# EAGLE design snes-bt2 (EAGLE 6.1)
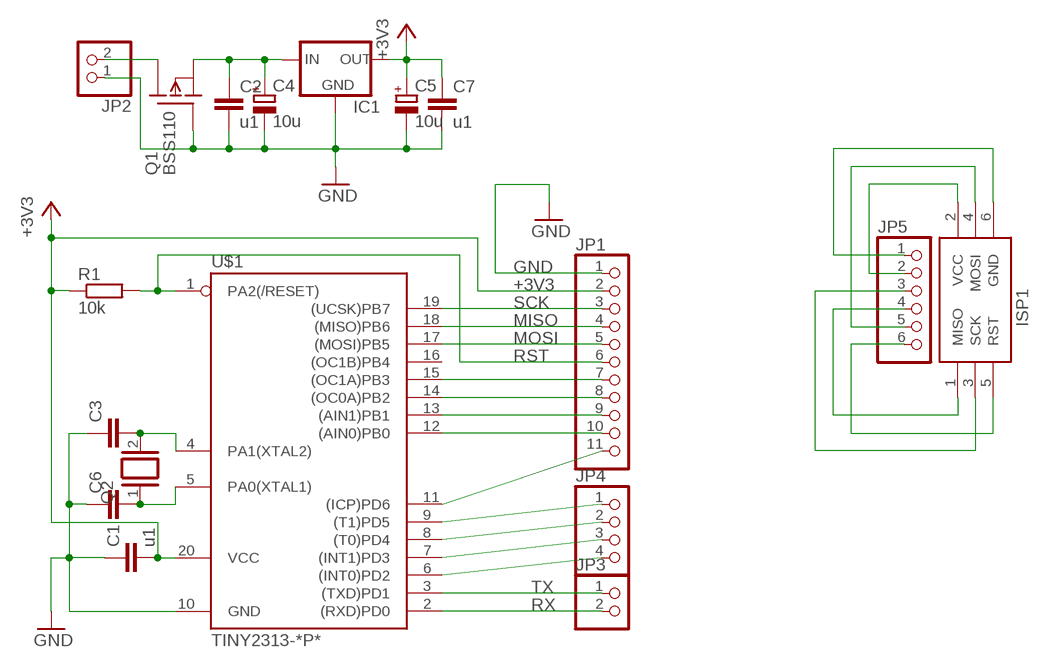
[diagram p0: schematic, sheet 1]

## Parts
C1  u1  C-EU025-025X050  [C025-025X050]
C2  u1  C-EU025-025X050  [C025-025X050]
C3  C-EUC0805K  [C0805K]
C4  10u  CPOL-EUE2,5-6E  [E2,5-6E]
C5  10u  CPOL-EUE2,5-6E  [E2,5-6E]
C6  C-EUC0805K  [C0805K]
C7  u1  C-EU025-025X050  [C025-025X050]
IC1  MCP1700_TO92-THIN  [TO-92]
ISP1  AVRISP-6  [AVRISP]
JP1  PINHD-1X11  [1X11]
JP2  PINHD-1X2  [1X02]
JP3  PINHD-1X2  [1X02]
JP4  PINHD-1X4  [1X04]
JP5  PINHD-1X6  [1X06]
Q1  BSS110  [TO92]
Q2  XTAL/S  [QS]
R1  10k  R-EU_0204/7  [0204/7]
U$1  TINY2313-*P*  [DIL20]

## Nets
+3V3: C1.2 C5.+ C7.1 IC1.3(OUT) JP1.2 R1.1 U$1.20(VCC)
GND: C1.1 C2.2 C3.1 C4.- C5.- C6.1 C7.2 IC1.1(GND) JP1.1 JP2.1 Q1.2(G) U$1.10(GND)
ISP_GND: ISP1.6(GND) JP5.1
MISO: JP1.4 U$1.18((MISO)PB6)
MOSI: JP1.5 U$1.17((MOSI)PB5)
N$1: C6.2 Q2.1 U$1.5(PA0(XTAL1))
N$2: C3.2 Q2.2 U$1.4(PA1(XTAL2))
N$3: JP1.11 U$1.11((ICP)PD6)
N$4: ISP1.2(VCC) JP5.2
N$5: C2.1 C4.+ IC1.2(IN) Q1.1(S)
N$6: JP2.2 Q1.3(D)
N$8: ISP1.4(MOSI) JP5.5
N$9: ISP1.1(MISO) JP5.4
N$10: ISP1.5(RST) JP5.6
N$11: ISP1.3(SCK) JP5.3
N$14: JP1.7 U$1.15((OC1A)PB3)
N$15: JP1.8 U$1.14((OC0A)PB2)
N$16: JP1.9 U$1.13((AIN1)PB1)
N$17: JP1.10 U$1.12((AIN0)PB0)
N$21: JP4.1 U$1.9((T1)PD5)
N$22: JP4.2 U$1.8((T0)PD4)
N$23: JP4.3 U$1.7((INT1)PD3)
N$24: JP4.4 U$1.6((INT0)PD2)
RST: JP1.6 R1.2 U$1.1(PA2(/RESET))
RX: JP3.2 U$1.2((RXD)PD0)
SCK: JP1.3 U$1.19((UCSK)PB7)
TX: JP3.1 U$1.3((TXD)PD1)
Unconnected: U$1.16((OC1B)PB4)

## Library data of the parts
C1-C3 C6 C7 = rcl:C-EU: CAPACITOR, European symbol
C4 C5 = rcl:CPOL-EU: POLARIZED CAPACITOR, European symbol
IC1 = _MY_OWN_LIB:MCP1700: VOLTAGE REGULATOR
ISP1 = adafruit:AVRISP: AVR ISP HEADER Standard 6 pin header for AVR programming
JP1 = pinhead:PINHD-1X11: PIN HEADER
JP2 JP3 = pinhead:PINHD-1X2: PIN HEADER
JP4 = pinhead:PINHD-1X4: PIN HEADER
JP5 = pinhead:PINHD-1X6: PIN HEADER
Q1 = transistor-fet:BSS110: P-Channel Enhancement MOSFET -50V; -0,17A; 6Ohm
Q2 = special:XTAL/S: CRYSTAL
R1 = rcl:R-EU_: RESISTOR, European symbol
U$1 = avr-7:TINY2313*: Atmel Tiny2313 2K Flash, 128 bytes EEPROM, 128 bytes RAM

## Board
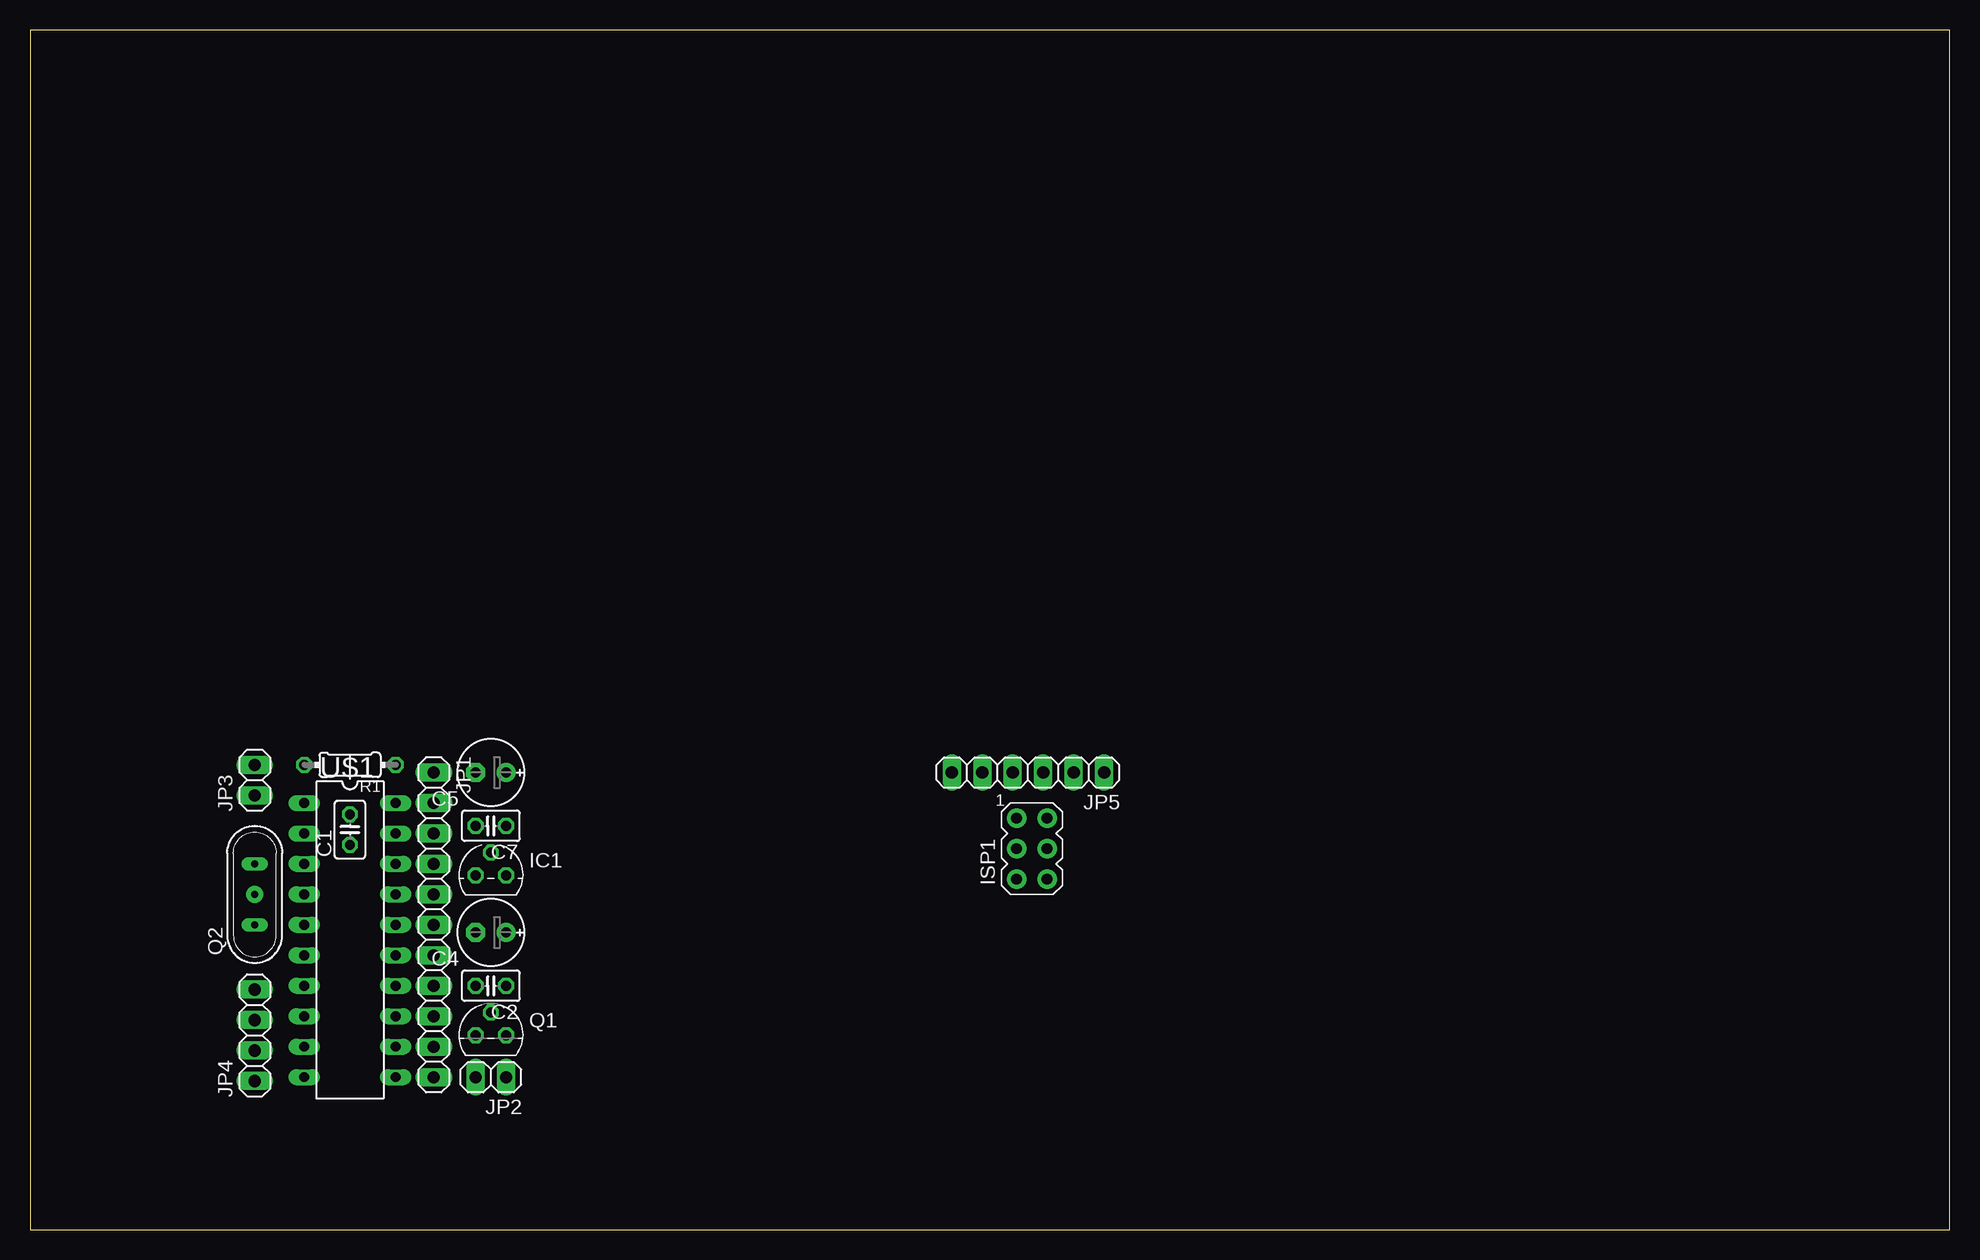
[diagram p1: board, top side]
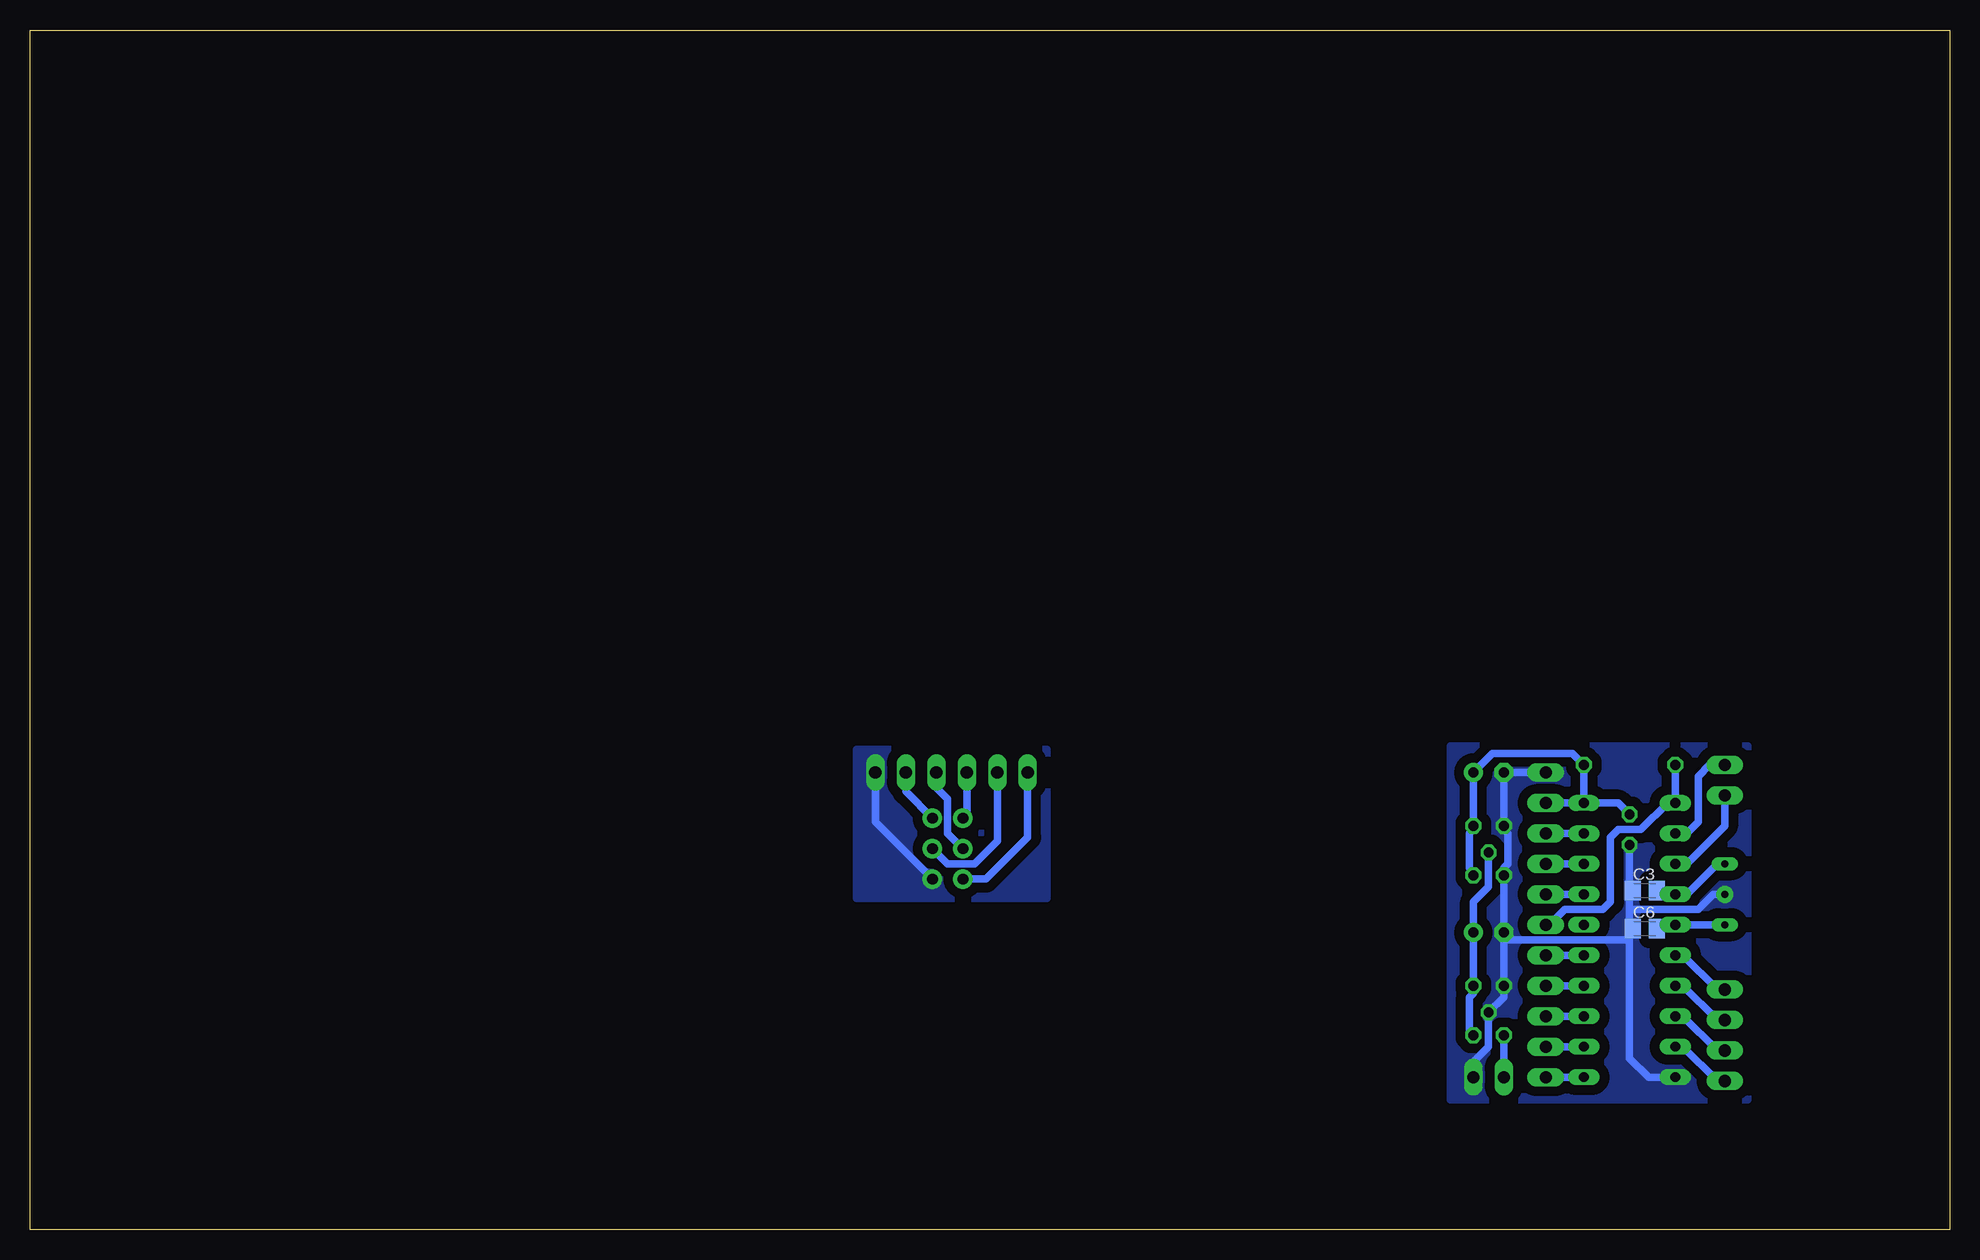
[diagram p2: board, bottom side, seen from below]

Size 160 x 100 mm. Coordinates in mm from the lower left corner, seen from the top.
Outline: 0,0 160,0 160,100 0,100 0,0
Copper layers (1*16): Top 0.035mm / dielectric 1.5mm / Bottom 0.035mm
Design rules: minimum track width 10mil, minimum drill 24mil, track to track 8mil, track to pad 8mil, pad to pad 8mil, via to via 8mil, smd to smd 8mil, copper to edge 40mil, drill to drill 8mil, minimum pad ring 10mil, minimum via ring 8mil, stop-mask expansion 4mil, vias tented up to drill 0mil, thermal gap 10mil

### Footprints (pad centres in the part's own frame; a part is rotated, then mirrored left to right if it is on the bottom)
C025-025X050 = drill 0.813 octagon: 1 -1.27,0; 2 1.27,0
C0805K = smd 1.3 x 1.6: 1 -1,0; 2 1,0
E2,5-6E = drill 0.813 pad 1.575: + -1.27,0 | drill 0.813 pad 1.575 octagon: - 1.27,0
TO-92 = drill 0.813 octagon: 1 -1.27,0; 2 0,1.905; 3 1.27,0
AVRISP = drill 0.9 pad 1.626: 1 -1.27,2.54; 2 1.27,2.54; 3 -1.27,0; 4 1.27,0; 5 -1.27,-2.54; 6 1.27,-2.54
1X11 = drill 1.016 long: 1 -12.7,0; 2 -10.16,0; 3 -7.62,0; 4 -5.08,0; 5 -2.54,0; 6 0,0; 7 2.54,0; 8 5.08,0; 9 7.62,0; 10 10.16,0; 11 12.7,0
1X02 = drill 1.016 long: 1 -1.27,0; 2 1.27,0
1X04 = drill 1.016 long: 1 -3.81,0; 2 -1.27,0; 3 1.27,0; 4 3.81,0
1X06 = drill 1.016 long: 1 -6.35,0; 2 -3.81,0; 3 -1.27,0; 4 1.27,0; 5 3.81,0; 6 6.35,0
TO92 = drill 0.813 octagon: 1 1.27,0; 2 0,1.905; 3 -1.27,0
QS = drill 0.61 long: 1 -2.54,0; 2 2.54,0
0204/7 = drill 0.813 octagon: 1 -3.81,0; 2 3.81,0
DIL20 = drill 0.813 long: 1 -11.43,-3.81; 2 -8.89,-3.81; 3 -6.35,-3.81; 4 -3.81,-3.81; 5 -1.27,-3.81; 6 1.27,-3.81; 7 3.81,-3.81; 8 6.35,-3.81; 9 8.89,-3.81; 10 11.43,-3.81; 11 11.43,3.81; 12 8.89,3.81; 13 6.35,3.81; 14 3.81,3.81; 15 1.27,3.81; 16 -1.27,3.81; 17 -3.81,3.81; 18 -6.35,3.81; 19 -8.89,3.81; 20 -11.43,3.81

### Placement (x,y rotation side)
C1  26.67,33.34 90 top
C2  38.42,20.32 180 top
C3  25.4,28.26 0 bottom
C4  38.42,24.77 180 top
C5  38.42,38.1 180 top
C6  25.4,25.08 0 bottom
C7  38.42,33.66 180 top
IC1  38.42,29.53 0 top
ISP1  83.5,31.75 0 top
JP1  33.66,25.4 270 top
JP2  38.42,12.7 180 top
JP3  18.73,37.47 90 top
JP4  18.73,16.19 90 top
JP5  83.19,38.1 180 top
Q1  38.42,16.19 0 top
Q2  18.73,27.94 90 top
R1  26.67,38.73 180 top
U$1  26.67,24.13 270 top

### Tracks (layer width: path | path; a pad name or v marks a point on that pad's centre or on a via)
+3V3
  Bottom 0.61: U$1.20 R1.1 31.43,39.69 38.1,39.69 C5.+ | IC1.3 40.01,30.16 40.01,33.02 39.69,33.34 C7.1 C5.+ | C5.+ 39.69,37.47 | JP1.2 U$1.20 | C1.2 27.62,35.56 U$1.20
GND  (via drill 0.6 pad 1.42)
  Bottom 0.61: U$1.10 25.08,12.7 26.67,14.29 26.67,24.13 | JP2.1 39.69,13.97 38.42,15.24 Q1.2 37.15,19.37 C2.2 37.15,24.13 | C1.1 26.67,28.26 | 37.15,24.13 C4.- IC1.1 37.15,30.16 36.83,30.48 36.83,33.02 37.15,33.34 C5.- JP1.1 | 26.67,25.08 26.67,24.13 | 26.67,24.13 37.15,24.13 | C6.1 26.67,25.08 | 26.67,25.08 26.67,26.67 | 26.67,26.67 26.67,28.26 | C3.1 26.67,28.26 | v18.73,27.94 19.68,27.94 20.95,26.67 26.67,26.67
  pour Bottom (isolate 0.813, no thermals): 41.59,10.79 16.83,10.79 16.83,40.32 41.59,40.32
ISP_GND
  Bottom 0.61: ISP1.6 89.53,33.97 JP5.1
  pour Bottom (isolate 0.813, no thermals): 75.25,40.01 91.12,40.01 91.12,27.62 75.25,27.62
MISO
  Bottom 0.61: U$1.18 JP1.4
MOSI
  Bottom 0.61: U$1.17 JP1.5
N$1
  Bottom 0.61: C6.2 24.13,25.08 23.81,25.4 U$1.5 Q2.1
N$2
  Bottom 0.61: C3.2 24.13,28.26 23.81,27.94 U$1.4 21.91,27.94 19.37,30.48 Q2.2
N$3
  Bottom 0.61: U$1.11 JP1.11
N$4
  Bottom 0.61: ISP1.2 87,36.51 JP5.2
N$5
  Bottom 0.61: Q1.1 40.01,16.51 40.01,19.37 39.69,19.68 C2.1 C4.+ 39.69,27.3 38.42,28.57 IC1.2
N$6
  Bottom 0.61: Q1.3 JP2.2
N$8
  Bottom 0.61: JP5.5 79.38,32.38 81.28,30.48 83.5,30.48 ISP1.4
N$9
  Bottom 0.61: JP5.4 81.92,34.61 ISP1.1
N$10
  Bottom 0.61: ISP1.5 80.33,29.21 76.83,32.7 JP5.6
N$11
  Bottom 0.61: ISP1.3 83.5,33.02 83.5,35.88 84.45,36.83 JP5.3
N$14
  Bottom 0.61: U$1.15 JP1.7
N$15
  Bottom 0.61: JP1.8 U$1.14
N$16
  Bottom 0.61: U$1.13 JP1.9
N$17
  Bottom 0.61: JP1.10 U$1.12
N$21
  Bottom 0.61: JP4.1 19.37,12.38 22.23,15.24 U$1.9
N$22
  Bottom 0.61: JP4.2 19.37,14.92 22.23,17.78 U$1.8
N$23
  Bottom 0.61: JP4.3 19.37,17.46 22.23,20.32 U$1.7
N$24
  Bottom 0.61: U$1.6 22.23,22.86 19.37,20 JP4.4
RST
  Bottom 0.61: R1.2 U$1.1 23.5,35.56 25.72,33.34 27.62,33.34 28.26,32.7 28.26,27.3 28.89,26.67 32.07,26.67 33.34,25.4 JP1.6
RX
  Bottom 0.61: U$1.2 21.91,33.02 20.95,33.97 20.95,37.78 20,38.73 JP3.2
SCK
  Bottom 0.61: U$1.19 JP1.3
TX
  Bottom 0.61: JP3.1 18.73,33.66 21.91,30.48 U$1.3